# EAGLE design utilidong-lipo-charger+septic-sepic-mk-1.0 (EAGLE 6.5.0)
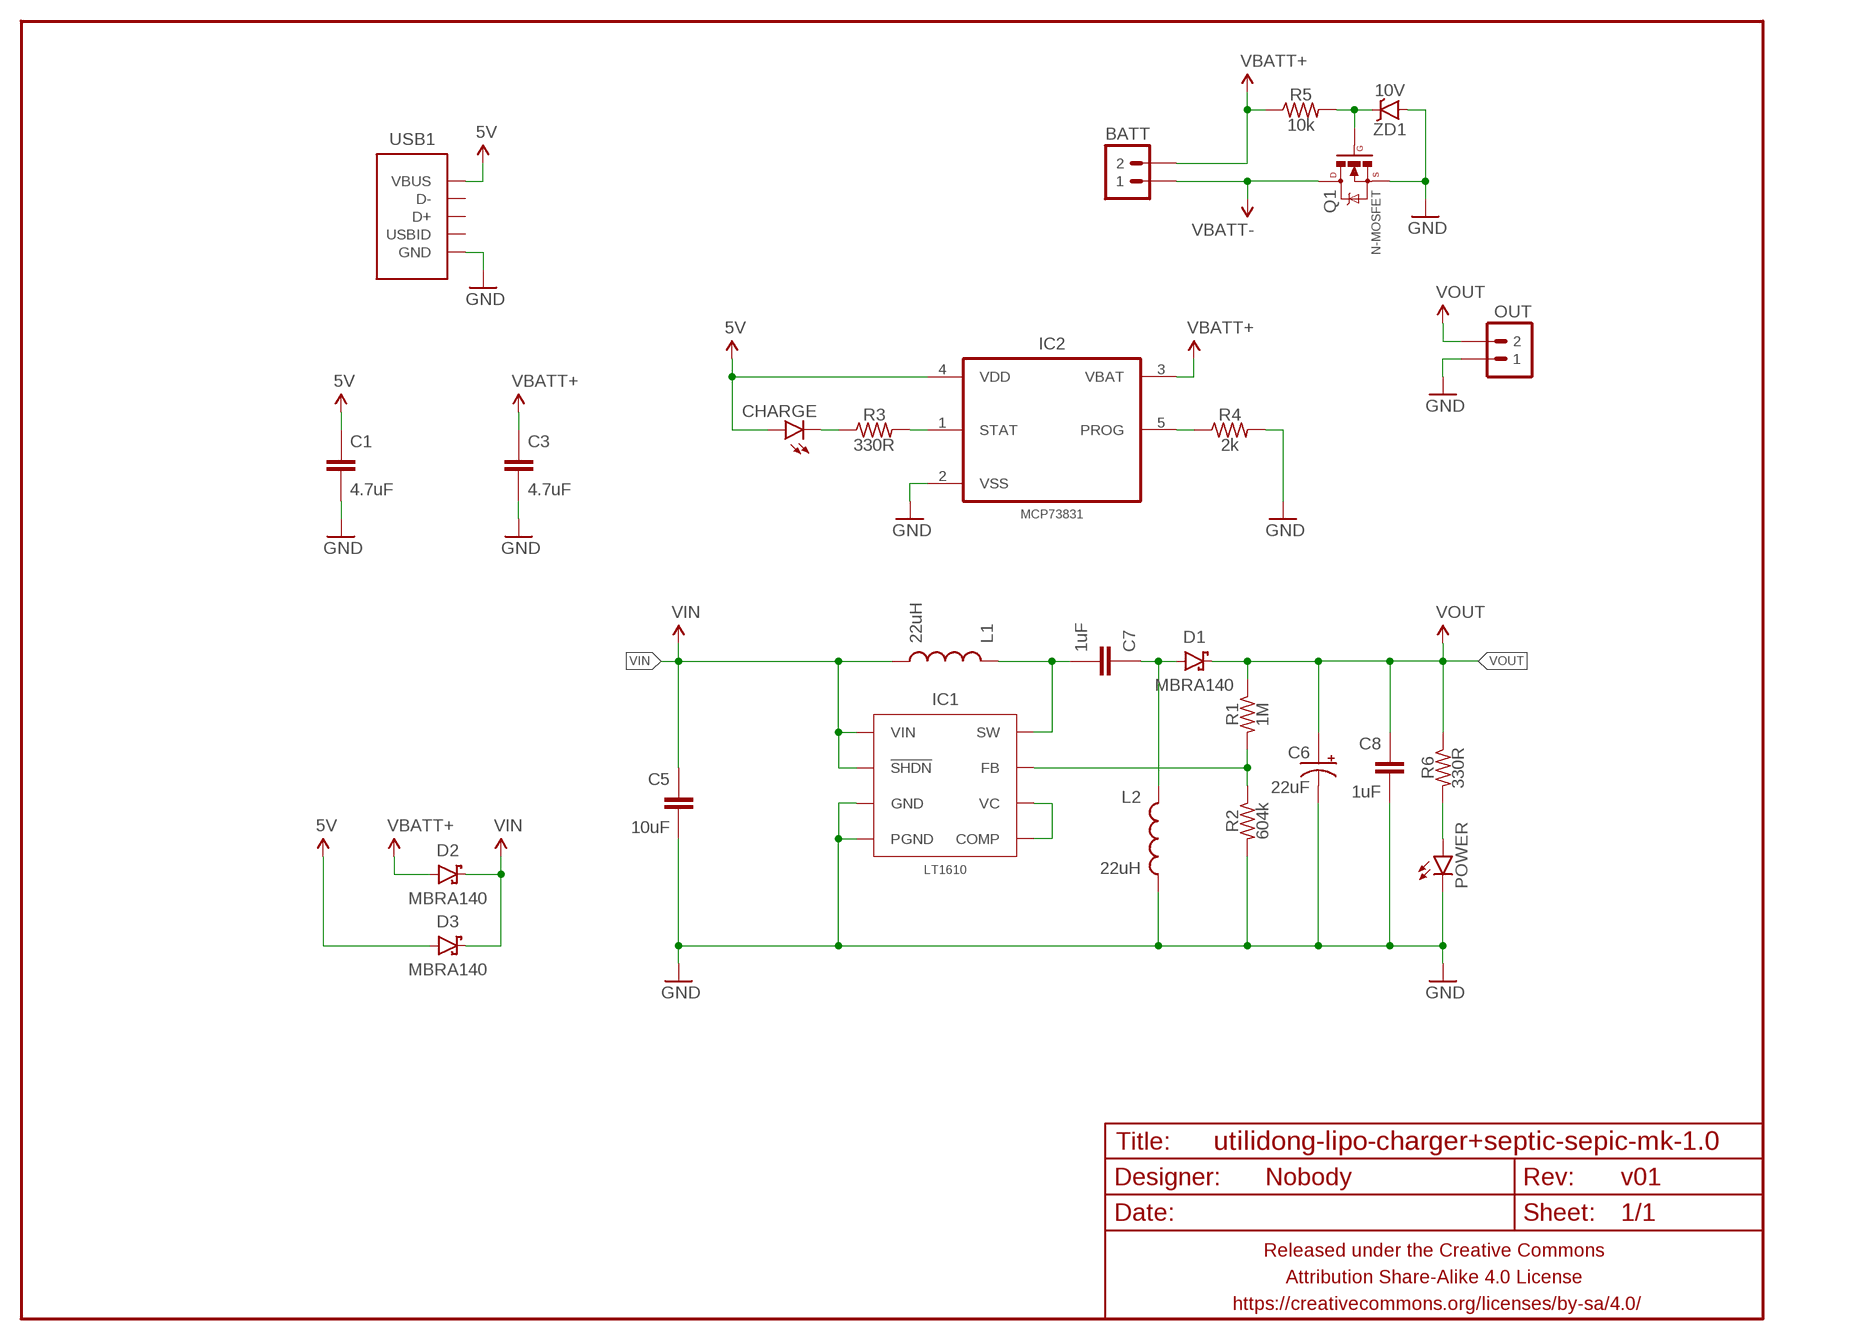
[diagram p0: schematic, sheet 1]

## Parts
BATT  M02PTH-CENTERED-R+  [1X02-CENTER-R+]
C1  4.7uF  CAPACITOR-CERAMICC0805  [C0805]
C3  4.7uF  CAPACITOR-CERAMICC0805  [C0805]
C5  10uF  CAPACITOR-CERAMICC0805  [C0805]
C6  22uF  CAPACITOR-POLARIZEDE2.5-6  [E2,5-6]
C7  1uF  CAPACITOR-CERAMICC0805  [C0805]
C8  1uF  CAPACITOR-CERAMICC0805  [C0805]
CHARGE  LED1206  [LED-1206]
D1  MBRA140  DIODE-SCHOTTKYSMA  [SMA-DIODE-SCHOTTKY]
D2  MBRA140  DIODE-SCHOTTKYMBRA140  [SMA-DIODE]
D3  MBRA140  DIODE-SCHOTTKYMBRA140  [SMA-DIODE]
FRAME1  FRAME-LETTERNO_PACKAGE  [DUMMY]
IC1  LT1610  LT1610SOICN8  [SO08]
IC2  MCP73831  MCP73831T-2ACI/OT  [SOT95P280X145-5N]
L1  22uH  INDUCTORTAIYO-YUDEN-40XX  [TAIYO-YUDEN-40XX]
L2  22uH  INDUCTORTAIYO-YUDEN-40XX  [TAIYO-YUDEN-40XX]
OUT  M02PTH-CENTERED-R+  [1X02-CENTER-R+]
POWER  LED1206  [LED-1206]
Q1  N-MOSFET  MOSFET-NCHANNELBSS138  [SOT23]
R1  1M  RESISTORR0805  [R0805]
R2  604k  RESISTORR0805  [R0805]
R3  330R  RESISTORR0805  [R0805]
R4  2k  RESISTORR0805  [R0805]
R5  10k  RESISTORR0805  [R0805]
R6  330R  RESISTORR0805  [R0805]
USB1  USB-ABCOMBO  [USB-MICRO-B-FCI-CUTOUT]
ZD1  10V  DIODE-ZENERSOD123  [SOD123-ZENER]

## Nets
5V: C1.1 CHARGE.A D3.A IC2.4(VDD) USB1.1(VBUS)
GND: C1.2 C3.2 C5.2 C6.- C8.2 IC1.4(PGND) IC1.7(GND) IC2.2(VSS) L2.2 OUT.1 POWER.C Q1.2(S) R2.2 R4.2 USB1.5(GND) USB1.P$1(GND) USB1.P$2(GND) ZD1.A
N$1: C7.1 D1.A L2.1
N$2: C7.2 IC1.5(SW) L1.1
N$3: POWER.A R6.2
N$4: IC1.1(VC) IC1.8(COMP)
N$5: IC2.1(STAT) R3.2
N$6: CHARGE.C R3.1
N$7: IC1.2(FB) R1.2 R2.1
N$8: IC2.5(PROG) R4.1
N$11: Q1.1(G) R5.2 ZD1.C
VBATT+: BATT.2 C3.1 D2.A IC2.3(VBAT) R5.1
VBATT-: BATT.1 Q1.3(D)
VIN: C5.1 D2.C D3.C IC1.3(!SHDN) IC1.6(VIN) L1.2
VOUT: C6.+ C8.1 D1.C OUT.2 R1.1 R6.1
Unconnected: USB1.2(D-) USB1.3(D+) USB1.4(USBID)

## Library data of the parts
BATT OUT = A_butts:M02: Standard 2-pin 0.1" header. Use with - straight break away headers ( PRT-00116) - right angle break away headers (PRT-00553) - swiss pins (PRT-00743) - machine pins (PRT-00117) - female headers (PRT-00115) Molex polarized connector foot print use with: PRT-08233 with associated crimp pins and housings. 2.54_SCREWTERM for use with PRT-10571. 3.5mm Screw Terminal footprints for PRT-08084 5mm Screw Terminal footprints for use with PRT-08433
C1 C3 C5 C7 C8 = A_butts:CAPACITOR-CERAMIC: CAPACITOR, European symbol
C6 = A_butts:CAPACITOR-POLARIZED: POLARIZED CAPACITOR, American symbol
CHARGE POWER = A_butts:LED: LEDs Standard schematic elements and footprints for 5mm, 3mm, 1206, and 0603 sized LEDs. 5mm - Spark Fun Electronics SKU : COM-00529 (and others)
D1 = A_butts:DIODE-SCHOTTKY: Schottky diodes in SFE's production catalog BAT20J 1A 23V 0.62Vf RB751 120mA 40V 0.37Vf PMEG4005EJ 0.5A 40V 0.42Vf MBRA140 1A 40V 0.5Vf B340A 3A 40V SMA
D2 D3 = A_butts:DIODE-SCHOTTKY: Schottky diodes in SFE's production catalog BAT20J 1A 23V 0.62Vf RB751 120mA 40V 0.37Vf PMEG4005EJ 0.5A 40V 0.42Vf MBRA140 1A 40V 0.5Vf B340A 3A 40V SMA; PROD_ID: DIO-08053
FRAME1 = A_butts:FRAME-LETTER: Schematic Frame Standard 8.5x11 US Letter frame; DESIGNER: Nobody; VERSION: v01
IC1 = A_butts:LT1610
IC2 = A_butts:MCP73831T-2ACI/OT: Charge Management Controller; MPN: MCP73831T-2ACI/OT; OC_FARNELL: 1332158; OC_NEWARK: 56K7045; PACKAGE: SOT-5; SUPPLIER: Microchip
L1 L2 = A_butts:INDUCTOR: Inductors Basic Inductor/Choke - 0603 and 1206. Footprints are not proven and vary greatly between part numbers. SRN6045- 33uH, 20% 1.4A SDR0403-560KL - 56uH, 10%, 500mA RMS/740mA peak
Q1 = A_butts:MOSFET-NCHANNEL: Common NMOSFET Parts MFG P/N Store ID Prod ID FDD8780 TRANS-09984 SI7820DN TRANS-11055 FDS6630A IC-08089 2N7002PW TRANS-11151 FQP30N06L COM-10213 TRANS-10060 BSS123LT1G TRANS-08345 BSS138 TRANS-00830 BS170 2N7000; PROD_ID: TRANS-00830
R1-R6 = A_butts:RESISTOR: RESISTOR, American symbol
USB1 = A_butts:USB-AB: This is a USB AB connector that is compatible with USB OTG. i.e. this connector can serve as a host or device
ZD1 = A_butts:DIODE-ZENER: Zener Diode Production Part - 8199 3.4V Zener Voltage

## Board
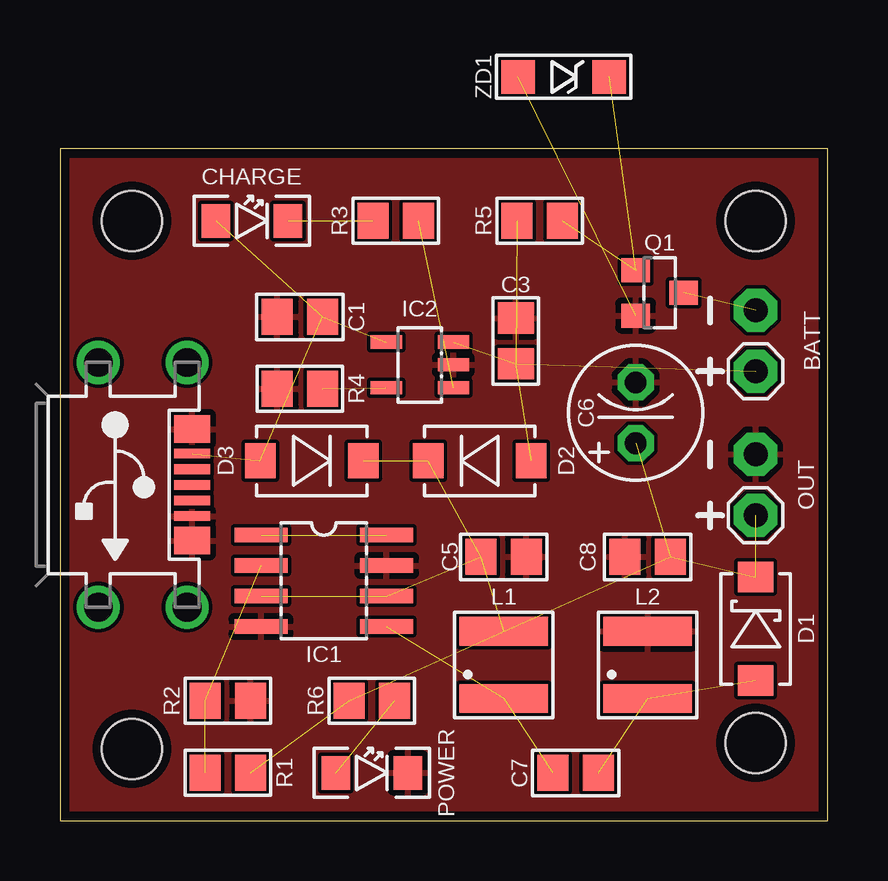
[diagram p1: board, top side]
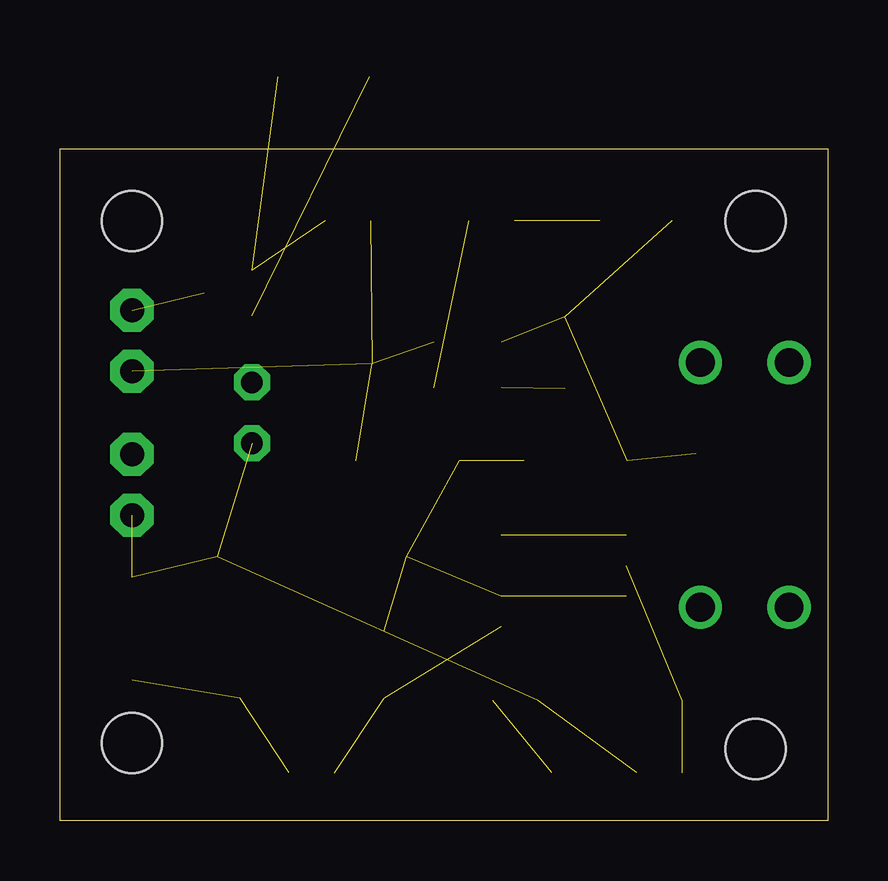
[diagram p2: board, bottom side, seen from below]

Size 32 x 28 mm. Coordinates in mm from the lower left corner, seen from the top.
Outline: 0,28 0,0 32,0 32,28 0,28
Copper layers (1*16): Top 0.0356mm / dielectric 1.5011mm / Bottom 0.0356mm
Design rules "LaenPCBOrder_2": minimum track width 6mil, minimum drill 13mil, track to track 6mil, track to pad 6mil, pad to pad 6mil, via to via 6mil, smd to smd 6mil, copper to edge 15mil, drill to drill 6mil, minimum pad ring 7mil, minimum via ring 7mil, stop-mask expansion 3mil, vias tented up to drill 20mil, thermal gap 10mil
Holes 2.5 mm at 3,25 3,3 29,3.25 29,25

### Footprints (pad centres in the part's own frame; a part is rotated, then mirrored left to right if it is on the bottom)
1X02-CENTER-R+ = drill 1 pad 1.8 octagon: 1 -1.27,0; 2 1.27,0
C0805 = smd 1.3 x 1.5: 1 -0.95,0; 2 0.95,0
E2,5-6 = drill 0.9 pad 1.5 octagon: + -1.27,0; - 1.27,0
LED-1206 = smd 1.2 x 1.4: A -1.5,0; C 1.5,0
SMA-DIODE-SCHOTTKY = smd 1.27 x 1.47: A -2.15,0; C 2.15,0
SMA-DIODE = smd 1.27 x 1.47: A -2.15,0; C 2.15,0
SO08 = smd 0.61 x 2.21: 1 -1.905,-2.616; 2 -0.635,-2.616; 3 0.635,-2.616; 4 1.905,-2.616; 5 1.905,2.616; 6 0.635,2.616; 7 -0.635,2.616; 8 -1.905,2.616
SOT95P280X145-5N = smd 1.3 x 0.55: 1 -1.4,0.95; 2 -1.4,0; 3 -1.4,-0.95; 4 1.4,-0.95; 5 1.4,0.95
TAIYO-YUDEN-40XX = smd 1.2 x 3.7: 1 -1.4,0; 2 1.4,0
SOT23 = smd 1 x 1.2: 1 -0.95,-1; 2 0.95,-1; 3 0,1
R0805 = smd 1.3 x 1.5: 1 -0.95,0; 2 0.95,0
USB-MICRO-B-FCI-CUTOUT = smd 0.4 x 1.5: 1 -1.3,0; 2 -0.65,0; 3 0,0; 4 0.65,0; 5 1.3,0 | smd 1.15 x 1.5: P$1 -2.325,0; P$2 2.325,0 | drill 1.2: P$3 -5.1,-0.2; P$4 5.1,-0.2; P$5 -5.1,-3.9; P$6 5.1,-3.9
SOD123-ZENER = smd 1.4 x 1.4: A -1.9,0; C 1.9,0

### Placement (x,y rotation side)
BATT  29,20 270 top
C1  10,21 180 top
C3  19,20 90 top
C5  18.5,11 0 top
C6  24,17 90 top
C7  21.5,2 180 top
C8  24.5,11 180 top
CHARGE  8,25 0 top
D1  29,8 90 top
D2  17.5,15 180 top
D3  10.5,15 0 top
FRAME1  0,0 0 top
IC1  11,10 270 top
IC2  15,19 180 top
L1  18.5,6.5 90 top
L2  24.5,6.5 90 top
OUT  29,14 270 top
POWER  13,2 0 top
Q1  25,22 270 top
R1  7,2 180 top
R2  7,5 0 top
R3  14,25 0 top
R4  10,18 180 top
R5  20,25 0 top
R6  13,5 0 top
U$8  [CC-BY-SA-4.0-NO-URL]  25.3,39.8 0 bottom  (outside the outline)
U$9  [COW_SMALL_METAL]  31.7,42.6 0 bottom  (outside the outline)
USB1  5.5,14 270 top
ZD1  21,31 0 top

### Tracks (layer width: path | path; a pad name or v marks a point on that pad's centre or on a via)
5V  (4 unrouted)
GND  (1 unrouted)
  pour Top: -0.1,-0.1 -0.1,28.1 32.1,28.1 32.1,-0.1
N$1  (2 unrouted)
N$2  (2 unrouted)
N$3  (1 unrouted)
N$4  (1 unrouted)
N$5  (1 unrouted)
N$6  (1 unrouted)
N$7  (2 unrouted)
N$8  (1 unrouted)
N$11  (2 unrouted)
VBATT+  (4 unrouted)
VBATT-  (1 unrouted)
VIN  (5 unrouted)
VOUT  (5 unrouted)

### Text on the board
Bottom: UtilDong / Lipo Charger & Septic SEPIC | by schizobovine / <sean@yak.net>
bPlace: UtilDong / Lipo Charger & Septic SEPIC | by schizobovine / <sean@yak.net>